# Altium schematic sheet STAC_Breakout_PCB.SchDoc
size C; SheetNumber: 1; SheetTotal: 1
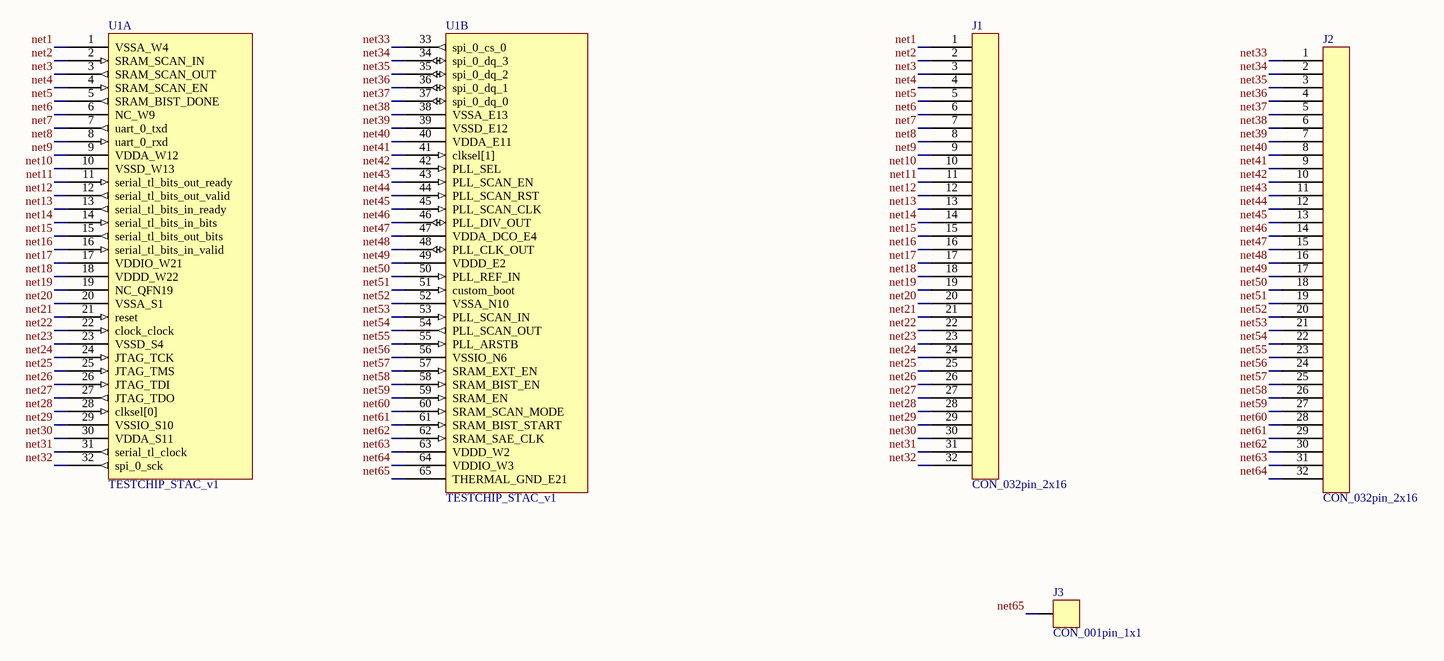
[diagram p0: STAC_Breakout_PCB.SchDoc]

## Parts
J1  CON_032pin_2x16  [CON-032-100-1600X200/2X16-POST]
J2  CON_032pin_2x16  [CON-032-100-1600X200/2X16-POST]
J3  CON_001pin_1x1  [CON-001-100-100X100/1X1-POST]
U1  TESTCHIP_STAC_v1  [STAC-QFN-64-.5-9.0X9.0/THERM-7.6]  (parts A,B of 2)

## Nets
net1: J1.1 U1.1(VSSA_W4)
net2: J1.2 U1.2(SRAM_SCAN_IN)
net3: J1.3 U1.3(SRAM_SCAN_OUT)
net4: J1.4 U1.4(SRAM_SCAN_EN)
net5: J1.5 U1.5(SRAM_BIST_DONE)
net6: J1.6 U1.6(NC_W9)
net7: J1.7 U1.7(uart_0_txd)
net8: J1.8 U1.8(uart_0_rxd)
net9: J1.9 U1.9(VDDA_W12)
net10: J1.10 U1.10(VSSD_W13)
net11: J1.11 U1.11(serial_tl_bits_out_ready)
net12: J1.12 U1.12(serial_tl_bits_out_valid)
net13: J1.13 U1.13(serial_tl_bits_in_ready)
net14: J1.14 U1.14(serial_tl_bits_in_bits)
net15: J1.15 U1.15(serial_tl_bits_out_bits)
net16: J1.16 U1.16(serial_tl_bits_in_valid)
net17: J1.17 U1.17(VDDIO_W21)
net18: J1.18 U1.18(VDDD_W22)
net19: J1.19 U1.19(NC_QFN19)
net20: J1.20 U1.20(VSSA_S1)
net21: J1.21 U1.21(reset)
net22: J1.22 U1.22(clock_clock)
net23: J1.23 U1.23(VSSD_S4)
net24: J1.24 U1.24(JTAG_TCK)
net25: J1.25 U1.25(JTAG_TMS)
net26: J1.26 U1.26(JTAG_TDI)
net27: J1.27 U1.27(JTAG_TDO)
net28: J1.28 U1.28(clksel[0])
net29: J1.29 U1.29(VSSIO_S10)
net30: J1.30 U1.30(VDDA_S11)
net31: J1.31 U1.31(serial_tl_clock)
net32: J1.32 U1.32(spi_0_sck)
net33: J2.1 U1.33(spi_0_cs_0)
net34: J2.2 U1.34(spi_0_dq_3)
net35: J2.3 U1.35(spi_0_dq_2)
net36: J2.4 U1.36(spi_0_dq_1)
net37: J2.5 U1.37(spi_0_dq_0)
net38: J2.6 U1.38(VSSA_E13)
net39: J2.7 U1.39(VSSD_E12)
net40: J2.8 U1.40(VDDA_E11)
net41: J2.9 U1.41(clksel[1])
net42: J2.10 U1.42(PLL_SEL)
net43: J2.11 U1.43(PLL_SCAN_EN)
net44: J2.12 U1.44(PLL_SCAN_RST)
net45: J2.13 U1.45(PLL_SCAN_CLK)
net46: J2.14 U1.46(PLL_DIV_OUT)
net47: J2.15 U1.47(VDDA_DCO_E4)
net48: J2.16 U1.48(PLL_CLK_OUT)
net49: J2.17 U1.49(VDDD_E2)
net50: J2.18 U1.50(PLL_REF_IN)
net51: J2.19 U1.51(custom_boot)
net52: J2.20 U1.52(VSSA_N10)
net53: J2.21 U1.53(PLL_SCAN_IN)
net54: J2.22 U1.54(PLL_SCAN_OUT)
net55: J2.23 U1.55(PLL_ARSTB)
net56: J2.24 U1.56(VSSIO_N6)
net57: J2.25 U1.57(SRAM_EXT_EN)
net58: J2.26 U1.58(SRAM_BIST_EN)
net59: J2.27 U1.59(SRAM_EN)
net60: J2.28 U1.60(SRAM_SCAN_MODE)
net61: J2.29 U1.61(SRAM_BIST_START)
net62: J2.30 U1.62(SRAM_SAE_CLK)
net63: J2.31 U1.63(VDDD_W2)
net64: J2.32 U1.64(VDDIO_W3)
net65: J3.1 U1.65(THERMAL_GND_E21)

## Library data of the parts
J3 = CON_001pin_1x1: Con 1 pin
U1 = TESTCHIP_STAC_v1: TESTCHIP STAC v1